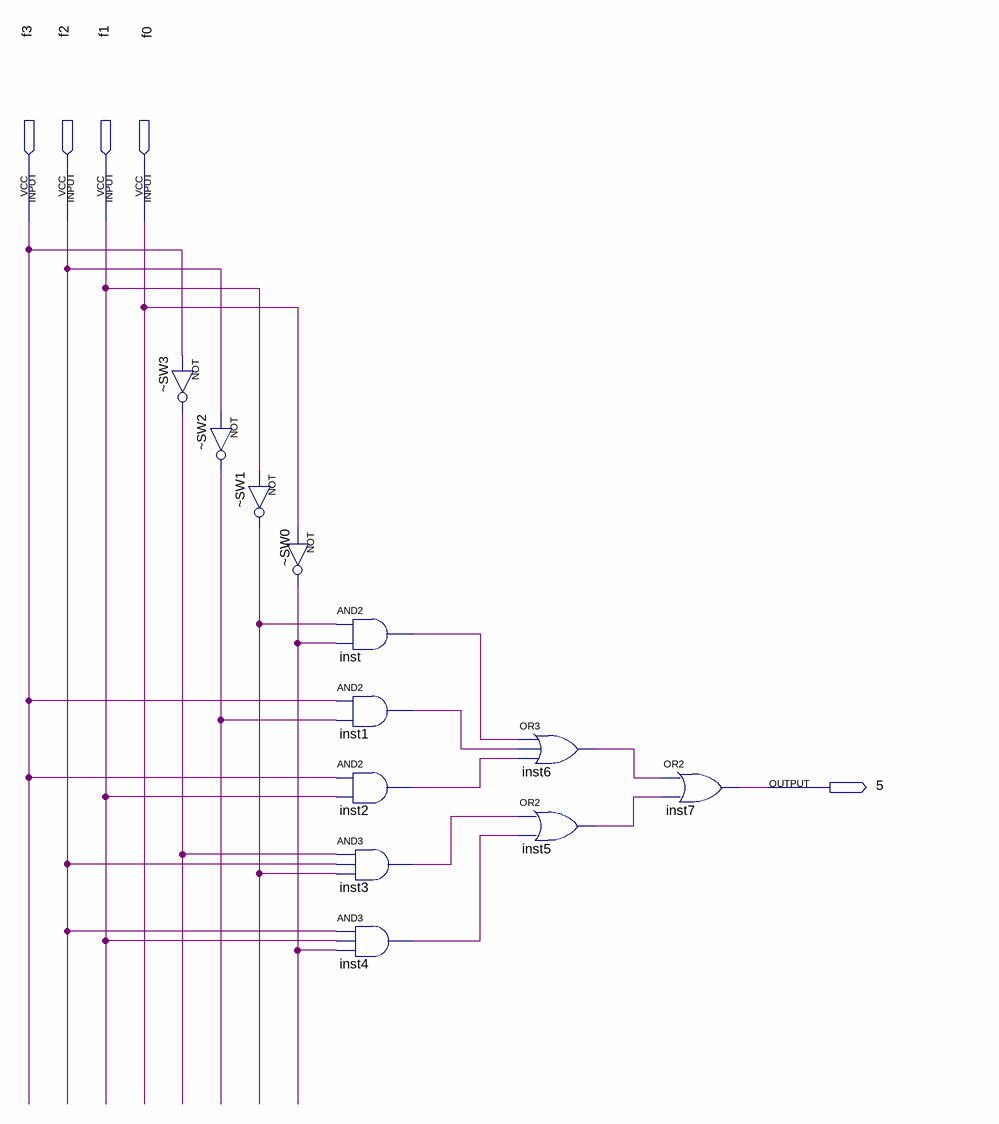
[diagram p0: schematic sheet]
// Quartus schematic 5.bdf as structural Verilog: 12 symbols, 5 pins
module \5  (
  input  f3,
  input  f2,
  input  f1,
  input  f0,
  output \5 
);

  wire _SW0_out, _SW1_out, _SW2_out, _SW3_out, inst1_out, inst2_out, inst3_out, inst4_out, inst5_out,
       inst6_out, inst_out;

  not \u_~SW3  (_SW3_out, f3);
  not \u_~SW2  (_SW2_out, f2);
  not \u_~SW1  (_SW1_out, f1);
  not \u_~SW0  (_SW0_out, f0);
  and inst (inst_out, _SW1_out, _SW0_out);
  and inst1 (inst1_out, f3, _SW2_out);
  and inst2 (inst2_out, f3, f1);
  and inst3 (inst3_out, _SW3_out, f2, _SW1_out);
  and inst4 (inst4_out, f2, f1, _SW0_out);
  or inst6 (inst6_out, inst_out, inst1_out, inst2_out);
  or inst5 (inst5_out, inst3_out, inst4_out);
  or inst7 (\5 , inst6_out, inst5_out);
endmodule
